# Altium schematic sheet LEDS_DISP.SchDoc
size 431 x 279 mm
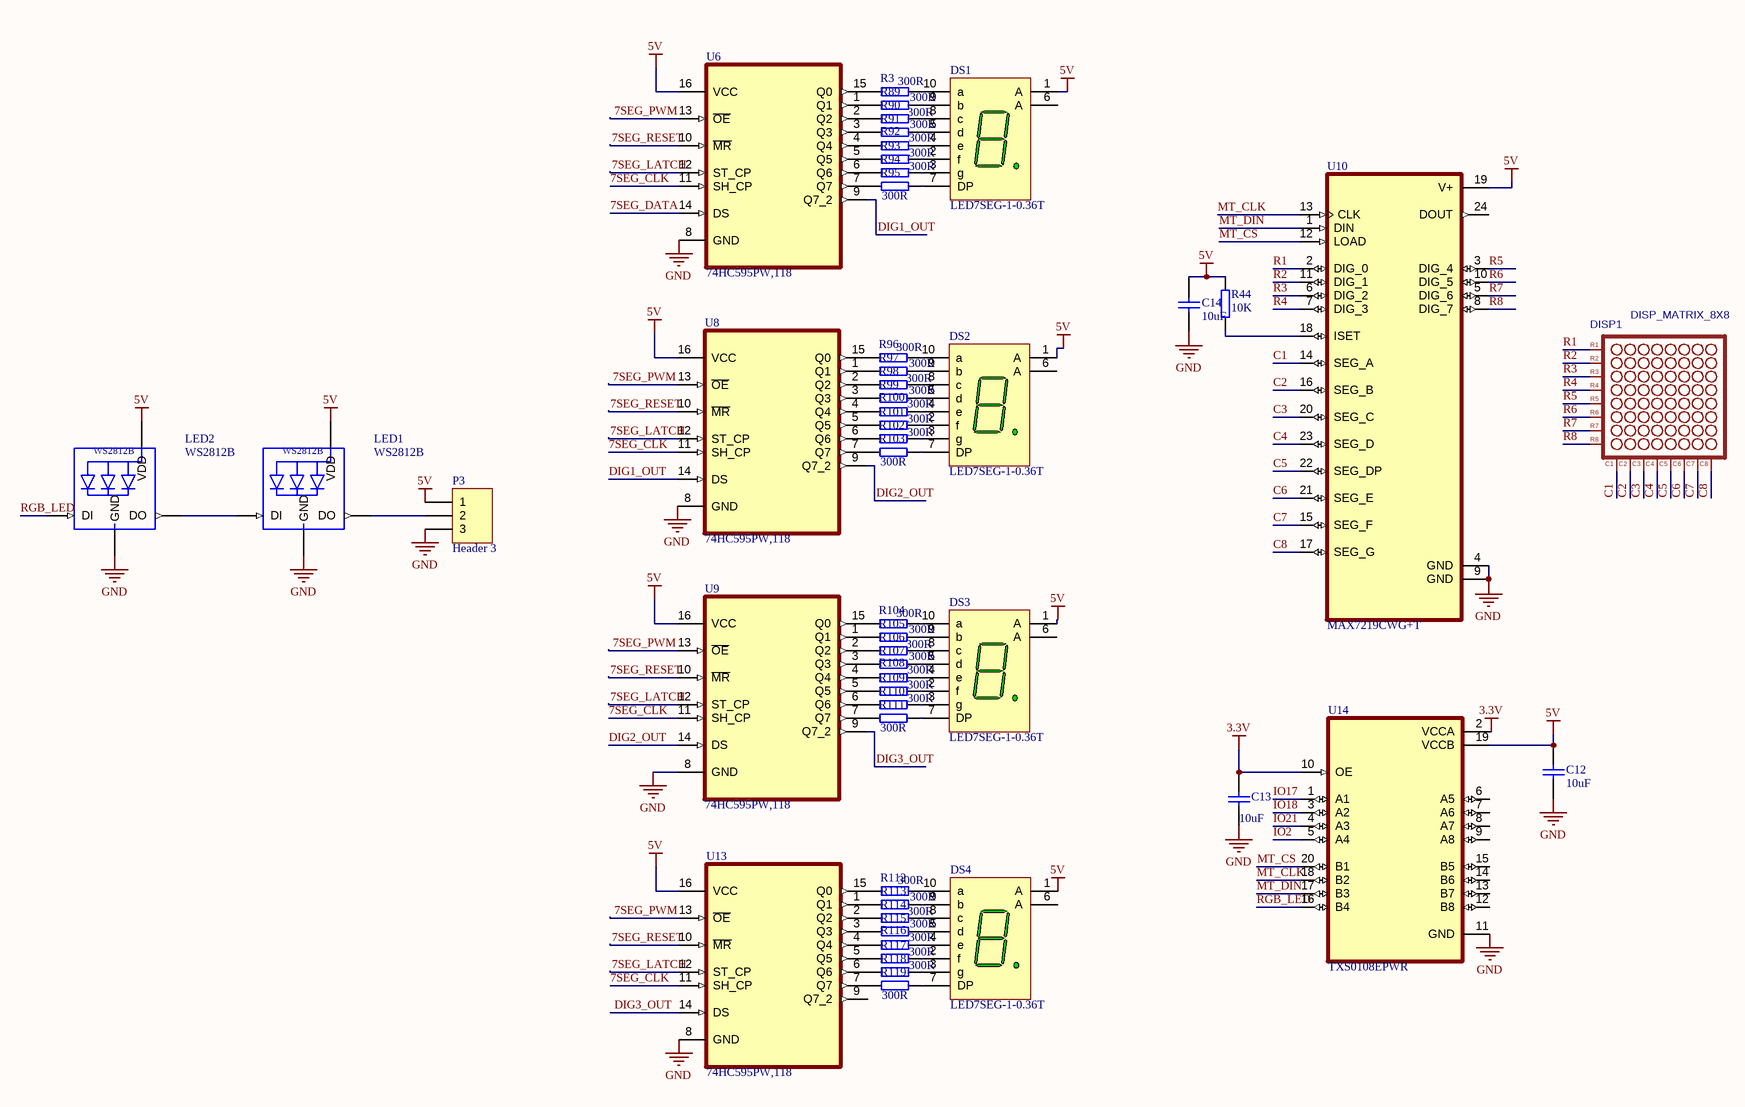
[diagram p0: LEDS_DISP.SchDoc]

## Parts
C12  value 10uF  [CAPC1608X90N]  (hidden comment: Cap Semi)
C13  value 10uF  [CAPC1608X90N]  (hidden comment: Cap Semi)
C14  value 10uF  [CAPC1608X90N]  (hidden comment: Cap Semi)
DISP1  DISP_MATRIX_8X8  [DISP_8X8_MATRIX_2020]
DS1  LED7SEG-1-0.36T  [LED7SEG-1-0.36T]
DS2  LED7SEG-1-0.36T  [LED7SEG-1-0.36T]
DS3  LED7SEG-1-0.36T  [LED7SEG-1-0.36T]
DS4  LED7SEG-1-0.36T  [LED7SEG-1-0.36T]
LED1  WS2812B  [WS2812B]
LED2  WS2812B  [WS2812B]
P3  Header 3  [HDR1X3]
R3  value 300R  [RESC1608N_ZERO]  (hidden comment: Resistor)
R44  value 10K  [RESC1608N_ZERO]  (hidden comment: Resistor)
R89  value 300R  [RESC1608N_ZERO]  (hidden comment: Resistor)
R90  value 300R  [RESC1608N_ZERO]  (hidden comment: Resistor)
R91  value 300R  [RESC1608N_ZERO]  (hidden comment: Resistor)
R92  value 300R  [RESC1608N_ZERO]  (hidden comment: Resistor)
R93  value 300R  [RESC1608N_ZERO]  (hidden comment: Resistor)
R94  value 300R  [RESC1608N_ZERO]  (hidden comment: Resistor)
R95  value 300R  [RESC1608N_ZERO]  (hidden comment: Resistor)
R96  value 300R  [RESC1608N_ZERO]  (hidden comment: Resistor)
R97  value 300R  [RESC1608N_ZERO]  (hidden comment: Resistor)
R98  value 300R  [RESC1608N_ZERO]  (hidden comment: Resistor)
R99  value 300R  [RESC1608N_ZERO]  (hidden comment: Resistor)
R100  value 300R  [RESC1608N_ZERO]  (hidden comment: Resistor)
R101  value 300R  [RESC1608N_ZERO]  (hidden comment: Resistor)
R102  value 300R  [RESC1608N_ZERO]  (hidden comment: Resistor)
R103  value 300R  [RESC1608N_ZERO]  (hidden comment: Resistor)
R104  value 300R  [RESC1608N_ZERO]  (hidden comment: Resistor)
R105  value 300R  [RESC1608N_ZERO]  (hidden comment: Resistor)
R106  value 300R  [RESC1608N_ZERO]  (hidden comment: Resistor)
R107  value 300R  [RESC1608N_ZERO]  (hidden comment: Resistor)
R108  value 300R  [RESC1608N_ZERO]  (hidden comment: Resistor)
R109  value 300R  [RESC1608N_ZERO]  (hidden comment: Resistor)
R110  value 300R  [RESC1608N_ZERO]  (hidden comment: Resistor)
R111  value 300R  [RESC1608N_ZERO]  (hidden comment: Resistor)
R112  value 300R  [RESC1608N_ZERO]  (hidden comment: Resistor)
R113  value 300R  [RESC1608N_ZERO]  (hidden comment: Resistor)
R114  value 300R  [RESC1608N_ZERO]  (hidden comment: Resistor)
R115  value 300R  [RESC1608N_ZERO]  (hidden comment: Resistor)
R116  value 300R  [RESC1608N_ZERO]  (hidden comment: Resistor)
R117  value 300R  [RESC1608N_ZERO]  (hidden comment: Resistor)
R118  value 300R  [RESC1608N_ZERO]  (hidden comment: Resistor)
R119  value 300R  [RESC1608N_ZERO]  (hidden comment: Resistor)
U6  74HC595PW,118  [SOP65P640X110-16N]
U8  74HC595PW,118  [SOP65P640X110-16N]
U9  74HC595PW,118  [SOP65P640X110-16N]
U10  MAX7219CWG+T  [SOIC127P1032X265-24N]
U13  74HC595PW,118  [SOP65P640X110-16N]
U14  TXS0108EPWR  [SOP65P640X120-20N]

## Nets
3.3V: C13.2 U14.2(VCCA) U14.10(OE)
5V: C12.1 C14.1 DS1.1(A) DS2.1(A) DS3.1(A) DS4.1(A) LED1.1-VDD(VDD) LED2.1-VDD(VDD) P3.1 R44.1 U6.16(VCC) U8.16(VCC) U9.16(VCC) U10.19(V+) U13.16(VCC) U14.19(VCCB)
GND: C12.2 C13.1 C14.2 LED1.3-GND(GND) LED2.3-GND(GND) P3.3 U6.8(GND) U8.8(GND) U9.8(GND) U10.4(GND) U10.9(GND) U13.8(GND) U14.11(GND)
7SEG_CLK: U6.11(SH_CP) U8.11(SH_CP) U9.11(SH_CP) U13.11(SH_CP)
7SEG_DATA: U6.14(DS)
7SEG_LATCH: U6.12(ST_CP) U8.12(ST_CP) U9.12(ST_CP) U13.12(ST_CP)
7SEG_PWM: U6.13(~{OE}) U8.13(~{OE}) U9.13(~{OE}) U13.13(~{OE})
7SEG_RESET: U6.10(~{MR}) U8.10(~{MR}) U9.10(~{MR}) U13.10(~{MR})
C1: DISP1.13(C1) U10.14(SEG_A)
C2: DISP1.3(C2) U10.16(SEG_B)
C3: DISP1.4(C3) U10.20(SEG_C)
C4: DISP1.10(C4) U10.23(SEG_D)
C5: DISP1.6(C5) U10.22(SEG_DP)
C6: DISP1.11(C6) U10.21(SEG_E)
C7: DISP1.15(C7) U10.15(SEG_F)
C8: DISP1.16(C8) U10.17(SEG_G)
DIG1_OUT: U6.9(Q7_2) U8.14(DS)
DIG2_OUT: U8.9(Q7_2) U9.14(DS)
DIG3_OUT: U9.9(Q7_2) U13.14(DS)
IO2: U14.5(A4)
IO17: U14.1(A1)
IO18: U14.3(A2)
IO21: U14.4(A3)
MT_CLK: U10.13(CLK) U14.18(B2)
MT_CS: U10.12(LOAD) U14.20(B1)
MT_DIN: U10.1(DIN) U14.17(B3)
R1: DISP1.9(R1) U10.2(DIG_0)
R2: DISP1.14(R2) U10.11(DIG_1)
R3: DISP1.8(R3) U10.6(DIG_2)
R4: DISP1.12(R4) U10.7(DIG_3)
R5: DISP1.1(R5) U10.3(DIG_4)
R6: DISP1.7(R6) U10.10(DIG_5)
R7: DISP1.2(R7) U10.5(DIG_6)
R8: DISP1.5(R8) U10.8(DIG_7)
RGB_LED: LED2.4-DIN(DI) U14.16(B4)
NetDS1_2: DS1.2(f) R93.1
NetDS1_3: DS1.3(g) R94.1
NetDS1_4: DS1.4(e) R92.1
NetDS1_5: DS1.5(d) R91.1
NetDS1_7: DS1.7(DP) R95.1
NetDS1_8: DS1.8(c) R90.1
NetDS1_9: DS1.9(b) R89.1
NetDS1_10: DS1.10(a) R3.1
NetDS2_2: DS2.2(f) R101.1
NetDS2_3: DS2.3(g) R102.1
NetDS2_4: DS2.4(e) R100.1
NetDS2_5: DS2.5(d) R99.1
NetDS2_7: DS2.7(DP) R103.1
NetDS2_8: DS2.8(c) R98.1
NetDS2_9: DS2.9(b) R97.1
NetDS2_10: DS2.10(a) R96.1
NetDS3_2: DS3.2(f) R109.1
NetDS3_3: DS3.3(g) R110.1
NetDS3_4: DS3.4(e) R108.1
NetDS3_5: DS3.5(d) R107.1
NetDS3_7: DS3.7(DP) R111.1
NetDS3_8: DS3.8(c) R106.1
NetDS3_9: DS3.9(b) R105.1
NetDS3_10: DS3.10(a) R104.1
NetDS4_2: DS4.2(f) R117.1
NetDS4_3: DS4.3(g) R118.1
NetDS4_4: DS4.4(e) R116.1
NetDS4_5: DS4.5(d) R115.1
NetDS4_7: DS4.7(DP) R119.1
NetDS4_8: DS4.8(c) R114.1
NetDS4_9: DS4.9(b) R113.1
NetDS4_10: DS4.10(a) R112.1
NetLED1_2-DOUT: LED1.2-DOUT(DO) P3.2
NetLED1_4-DIN: LED1.4-DIN(DI) LED2.2-DOUT(DO)
NetR3_2: R3.2 U6.15(Q0)
NetR44_2: R44.2 U10.18(ISET)
NetR89_2: R89.2 U6.1(Q1)
NetR90_2: R90.2 U6.2(Q2)
NetR91_2: R91.2 U6.3(Q3)
NetR92_2: R92.2 U6.4(Q4)
NetR93_2: R93.2 U6.5(Q5)
NetR94_2: R94.2 U6.6(Q6)
NetR95_2: R95.2 U6.7(Q7)
NetR96_2: R96.2 U8.15(Q0)
NetR97_2: R97.2 U8.1(Q1)
NetR98_2: R98.2 U8.2(Q2)
NetR99_2: R99.2 U8.3(Q3)
NetR100_2: R100.2 U8.4(Q4)
NetR101_2: R101.2 U8.5(Q5)
NetR102_2: R102.2 U8.6(Q6)
NetR103_2: R103.2 U8.7(Q7)
NetR104_2: R104.2 U9.15(Q0)
NetR105_2: R105.2 U9.1(Q1)
NetR106_2: R106.2 U9.2(Q2)
NetR107_2: R107.2 U9.3(Q3)
NetR108_2: R108.2 U9.4(Q4)
NetR109_2: R109.2 U9.5(Q5)
NetR110_2: R110.2 U9.6(Q6)
NetR111_2: R111.2 U9.7(Q7)
NetR112_2: R112.2 U13.15(Q0)
NetR113_2: R113.2 U13.1(Q1)
NetR114_2: R114.2 U13.2(Q2)
NetR115_2: R115.2 U13.3(Q3)
NetR116_2: R116.2 U13.4(Q4)
NetR117_2: R117.2 U13.5(Q5)
NetR118_2: R118.2 U13.6(Q6)
NetR119_2: R119.2 U13.7(Q7)

Not connected (* = marked no-connect by the designer): DS1 6(A); DS2 6(A); DS3 6(A); DS4 6(A); U10 24(DOUT); U13 9(Q7_2); U14 6(A5) 7(A6) 8(A7) 9(A8) 12(B8) 13(B7) 14(B6) 15(B5)

## Notes on the sheet
- DWG. NO.
- REV.
- SHT.
- THIS DOCUMENT AND THE DATA DISCLOSED HEREIN OR HEREWITH IS THE PROPERTY OF ALTIUM LIMITED AND MAY BE FREELY DISTRIBUTED IN WHOLE. NO RIGHTS ARE RESERVED OR EXPRESS OR IMPLIED WARANTEE GIVEN.
- REVISION
- DESCRIPTION
- DATE
- APPROVED
- ENG:
- APPROVALS
- PROJECT
- DSN:
- CHK:
- REFERENCE DOCUMENTS
- PROJECT REVISION:
- TITLE
- DOCUMENT REVISION:
- DESIGN ITEM:
- BOM:
- FAB DWG:
- PCB DWG:
- ASSY DWG:
- SCALE:
- SIZE
- B
- CAGE CODE
- FILE NAME
- DWG NO.
- SHEET
- OF
- REV

## Library data of the parts
C12-C14 = CAP-SM-0603-X5R-10uF: CAP SM 0603 X5R 10uF 10%; Tolerance: ±10%; Supplier 1: Farnell; Supplier 2: Digi-Key; Supplier Part Number 1: 2366833; Supplier Part Number 2: 490-3896-1-ND
DISP1 = DISP_MATRIX_8X8: catid: 20; Contributor: DangerousPrototype; BOM_Manufacturer Part: ?; spicePre: D
DS1-DS4 = LED7SEG-1-0.36T: 7.6 mm Micro Bright Green 7-Segment Display: CA, RH DP; Note: Pins 1 and 6 are redundant Anodes.; Published: 26-May-2004; LatestRevisionDate: 11-Oct-2004; LatestRevisionNote: Display outline superimposed on PCB Footprint.; DatasheetVersion: 11-Feb-2002; PackageVersion: 11-Feb-2002; PackageReference: A; Publisher: Altium Limited; PackageDescription: LED, 7-Segment Display, 7.62 mm, RHD; 10 Leads; Row Space 5.08 mm; Pitch 2.54 mm; ComponentLink1Description: Manufacturer Link; ComponentLink1URL: http://www.avagotech.com/; ComponentLink2Description: Datasheet; ComponentLink2URL: http://cp.literature.agilent.com/litweb/pdf/5988-4434EN.pdf
LED1 LED2 = WS2812B: Raspberry Pi HAT _40 pin_ Wheeled Robotics Kit; MF: SparkFun Electronics; Availability: Unavailable; SnapEDA_Link: https://www.snapeda.com/parts/WS2812B/Worldsemi/view-part/1038297/?ref=snap; MP: WS2812B; Price: None; Value: *; Package: None
P3 = Header 3: Header, 3-Pin; LatestRevisionDate: 17-Jul-2002; LatestRevisionNote: Re-released for DXP Platform.; Publisher: Altium Limited
R3 R89-R119 = RES-SM-0603-10K: RES SM 0603 300R; Supplier 1: Farnell; Supplier 2: Digi-Key; Supplier Part Number 1: 9330399; Supplier Part Number 2: 541-10.0KHCT-ND
R44 = RES-SM-0603-10K: RES SM 0603 10K; Supplier 1: Farnell; Supplier 2: Digi-Key; Supplier Part Number 1: 9330399; Supplier Part Number 2: 541-10.0KHCT-ND
U6 U8 U9 U13 = 74HC595PW,118: Shift Shift Register 1 Element 8 Bit 16-TSSOP; MF: Nexperia USA; SnapEDA_Link: https://www.snapeda.com/parts/74HC595PW,118/Nexperia/view-part/?ref=snap; Package: TSSOP16-16 Nexperia USA Inc.; Value: *; MP: 74HC595PW,118; Check_prices: https://www.snapeda.com/parts/74HC595PW,118/Nexperia/view-part/?ref=eda
U10 = MAX7219CWG+T: LED Driver 64 Segment 330000uA Supply Current 24-Pin SOIC W T/R; MF: Maxim Integrated Products; SnapEDA_Link: https://www.snapeda.com/parts/MAX7219CWG+T/Maxim+Integrated/view-part/?ref=snap; Package: None; Value: *; MP: MAX7219CWG+T; Check_prices: https://www.snapeda.com/parts/MAX7219CWG+T/Maxim+Integrated/view-part/?ref=eda
U14 = TXS0108EPWR: 8-bit bidirectional voltage-level shifter for open-drain and push-pull application; MF: Texas Instruments; Value: *; SnapEDA_Link: https://www.snapeda.com/parts/TXS0108EPWR/Texas+Instruments/view-part/?ref=snap; Purchase-URL: https://pricing.snapeda.com/search/part/TXS0108EPWR/?ref=eda; Availability: In Stock; Price: None; Package: TSSOP-20 Texas Instruments; Check_prices: https://www.snapeda.com/parts/TXS0108EPWR/Texas+Instruments/view-part/?ref=eda; MP: TXS0108EPWR